# EAGLE design TUD (EAGLE 6.2)
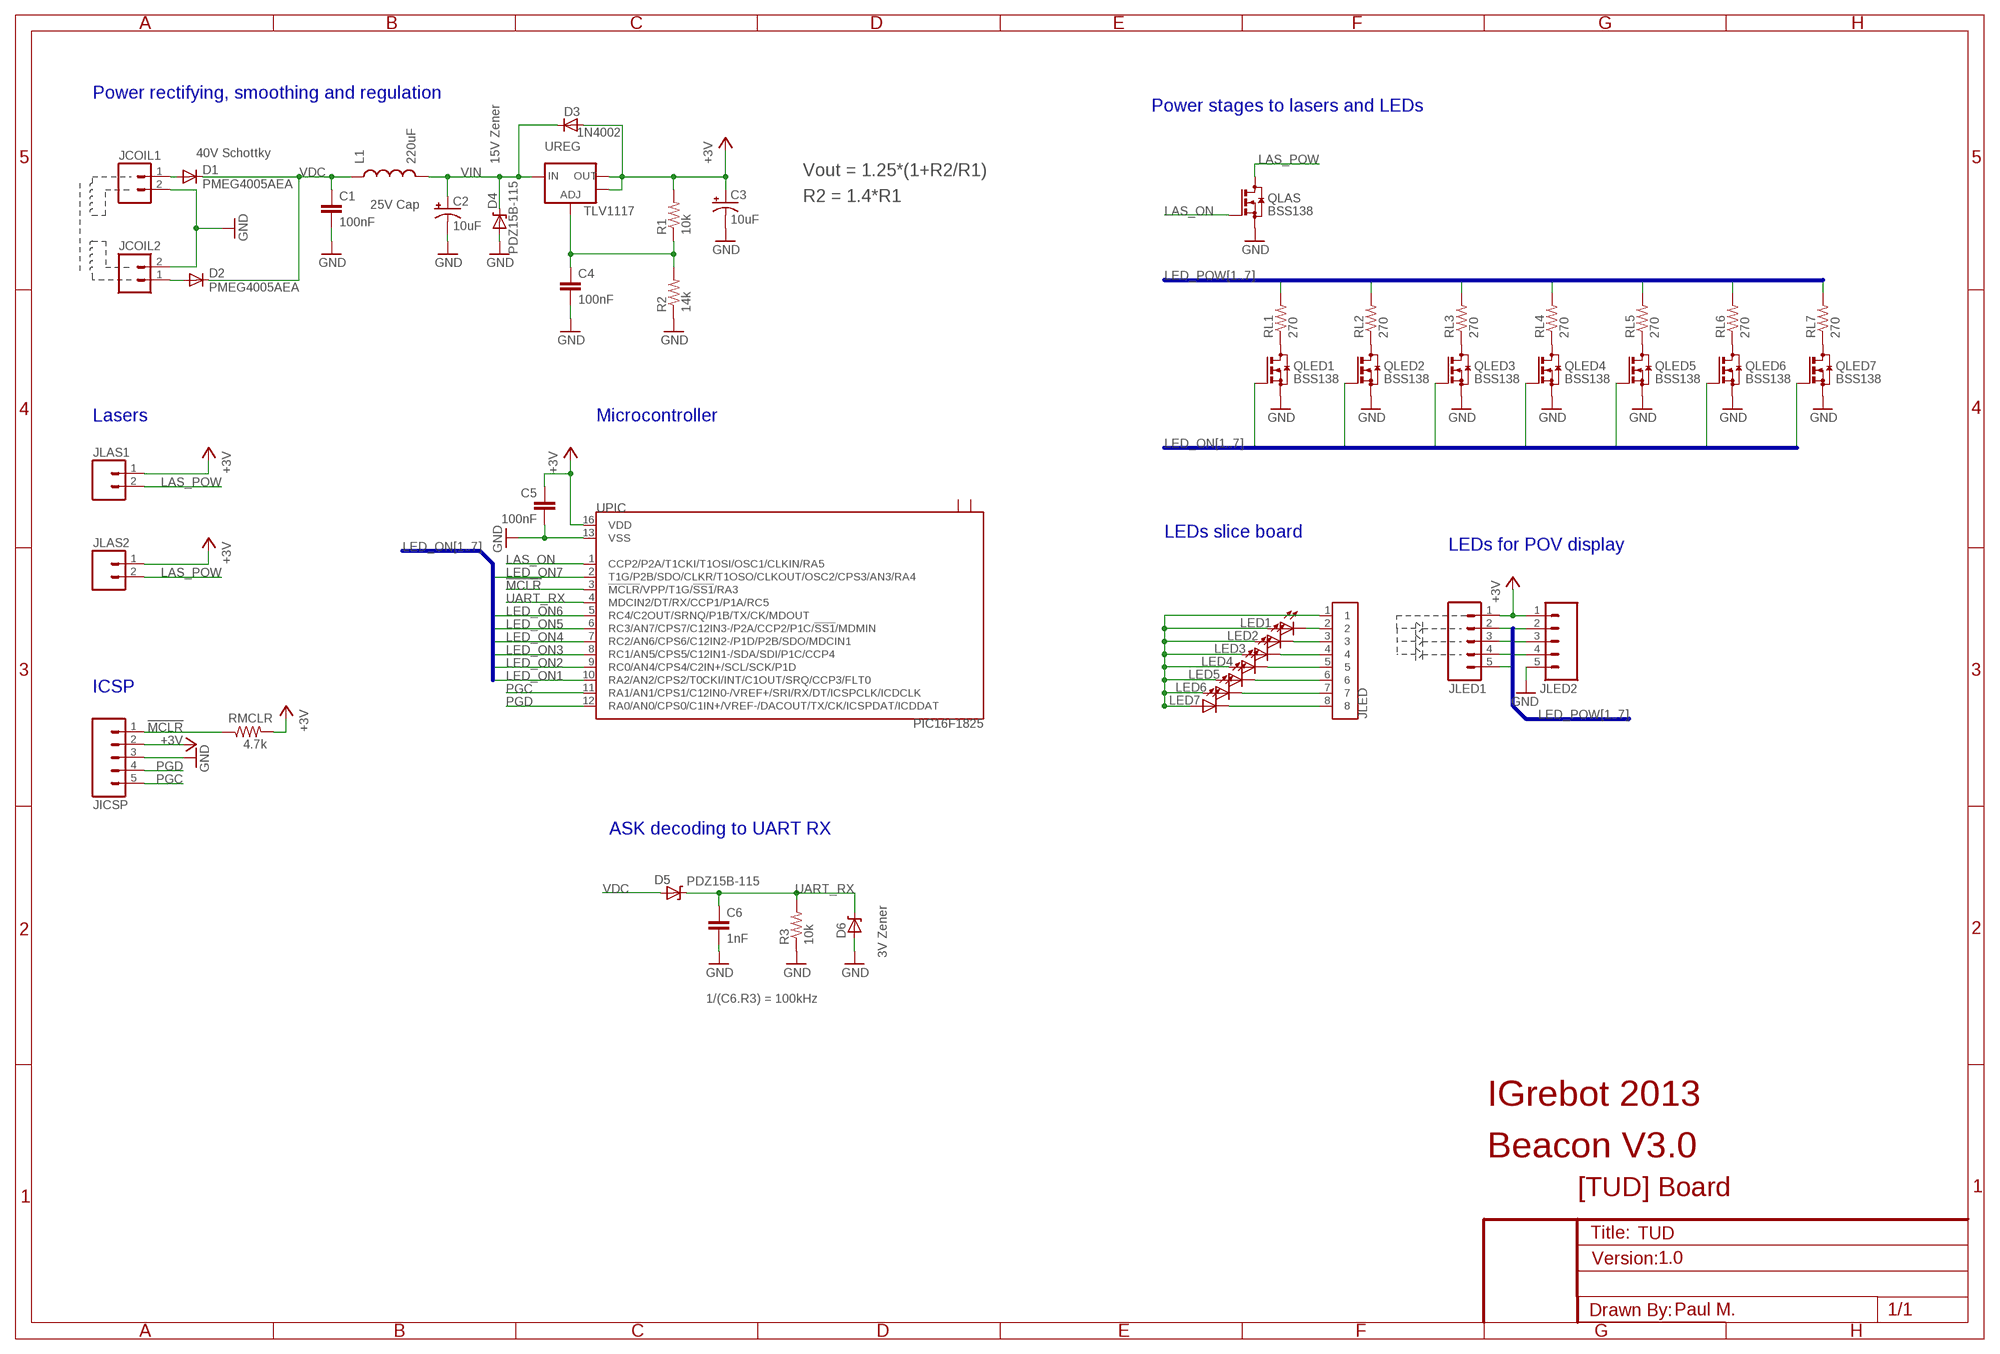
[diagram p0: schematic, sheet 1]

## Parts
C1  100nF  CAP0603-CAP  [0603-CAP]
C2  10uF  CAP_POL3528  [EIA3528]
C3  10uF  CAP_POL3528  [EIA3528]
C4  100nF  CAP0603-CAP  [0603-CAP]
C5  100nF  CAP0603-CAP  [0603-CAP]
C6  1nF  CAP0603-CAP  [0603-CAP]
D1  PMEG4005AEA  DIODESOD  [SOD-323]
D2  PMEG4005AEA  DIODESOD  [SOD-323]
D3  1N4002  DIODESOD  [SOD-323]
D4  PDZ15B-115  DIODE-ZENER-BZT52  [SOD-323]
D5  PDZ15B-115  DIODE-ZENER-BZT52  [SOD-323]
D6  DIODE-ZENER-BZT52  [SOD-323]
JCOIL1  M02LOCK  [1X02_LOCK]
JCOIL2  M02LOCK  [1X02_LOCK]
JICSP  M051.27MM  [1X05-1.27MM]
JLAS1  M02LOCK  [1X02_LOCK]
JLAS2  M02LOCK  [1X02_LOCK]
JLED  CON8_SMD-1  [CON8-SMD-1]
JLED1  M051.27MM  [1X05-1.27MM]
JLED2  M051.27MM  [1X05-1.27MM]
L1  220uF  MCSDC0503-221KU  [L-5X5]
LED1  LED0603  [LED-0603]
LED2  LED0603  [LED-0603]
LED3  LED0603  [LED-0603]
LED4  LED0603  [LED-0603]
LED5  LED0603  [LED-0603]
LED6  LED0603  [LED-0603]
LED7  LED0603  [LED-0603]
QLAS  BSS138  BSS123  [SOT23]
QLED1  BSS138  BSS123  [SOT23]
QLED2  BSS138  BSS123  [SOT23]
QLED3  BSS138  BSS123  [SOT23]
QLED4  BSS138  BSS123  [SOT23]
QLED5  BSS138  BSS123  [SOT23]
QLED6  BSS138  BSS123  [SOT23]
QLED7  BSS138  BSS123  [SOT23]
R1  10k  RESISTOR0603-RES  [0603-RES]
R2  14k  RESISTOR0603-RES  [0603-RES]
R3  10k  RESISTOR0603-RES  [0603-RES]
RL1  270  RESISTOR0603-RES  [0603-RES]
RL2  270  RESISTOR0603-RES  [0603-RES]
RL3  270  RESISTOR0603-RES  [0603-RES]
RL4  270  RESISTOR0603-RES  [0603-RES]
RL5  270  RESISTOR0603-RES  [0603-RES]
RL6  270  RESISTOR0603-RES  [0603-RES]
RL7  270  RESISTOR0603-RES  [0603-RES]
RMCLR  4.7k  RESISTOR0603-RES  [0603-RES]
UPIC  PIC16F1825  [QFN16-0.65]
UREG  TLV1117  V_REG_LM1117SOT223  [SOT223]

## Nets
!MCLR!: JICSP.1 RMCLR.1 UPIC.3(!MCLR!/VPP/T1G/!SS1!/RA3)
+3V3: C3.A(+) C5.1 D3.2(A) JICSP.2 JLAS1.1 JLAS2.1 JLED1.1 JLED2.1 R1.2 RMCLR.2 UPIC.16(VDD) UREG.2(OUT) UREG.4(OUT) ; supply symbol labelled +3V
GND: C1.2 C2.C(-) C3.C(-) C4.2 C5.2 C6.2 D4.2(A) D6.2(A) JCOIL1.2 JCOIL2.2 JICSP.3 JLED2.5 QLAS.2(S) QLED1.2(S) QLED2.2(S) QLED3.2(S) QLED4.2(S) QLED5.2(S) QLED6.2(S) QLED7.2(S) R2.1 R3.1 UPIC.13(VSS)
LAS_ON: QLAS.1(G) UPIC.1(CCP2/P2A/T1CKI/T1OSI/OSC1/CLKIN/RA5)
LAS_POW: JLAS1.2 JLAS2.2 QLAS.3(D)
LED_ON1: QLED1.1(G) UPIC.10(RA2/AN2/CPS2/T0CKI/INT/C1OUT/SRQ/CCP3/FLT0)
LED_ON2: QLED2.1(G) UPIC.9(RC0/AN4/CPS4/C2IN+/SCL/SCK/P1D)
LED_ON3: QLED3.1(G) UPIC.8(RC1/AN5/CPS5/C12IN1-/SDA/SDI/P1C/CCP4)
LED_ON4: QLED4.1(G) UPIC.7(RC2/AN6/CPS6/C12IN2-/P1D/P2B/SDO/MDCIN1)
LED_ON5: QLED5.1(G) UPIC.6(RC3/AN7/CPS7/C12IN3-/P2A/CCP2/P1C/!SS1!/MDMIN)
LED_ON6: QLED6.1(G) UPIC.5(RC4/C2OUT/SRNQ/P1B/TX/CK/MDOUT)
LED_ON7: QLED7.1(G) UPIC.2(T1G/P2B/SDO/CLKR/T1OSO/CLKOUT/OSC2/CPS3/AN3/RA4)
LED_POW1: JLED1.2 RL1.2
LED_POW2: JLED1.3 RL2.2
LED_POW3: JLED1.4 RL3.2
LED_POW4: JLED1.5 RL4.2
LED_POW5: JLED2.2 RL5.2
LED_POW6: JLED2.3 RL6.2
LED_POW7: JLED2.4 RL7.2
N$1: JLED.2 LED1.C
N$2: D1.2(A) JCOIL1.1
N$3: D2.2(A) JCOIL2.1
N$4: JLED.3 LED2.C
N$5: QLED1.3(D) RL1.1
N$6: C4.1 R1.1 R2.2 UREG.1(ADJ)
N$7: QLED2.3(D) RL2.1
N$8: QLED3.3(D) RL3.1
N$9: QLED4.3(D) RL4.1
N$10: QLED5.3(D) RL5.1
N$11: QLED6.3(D) RL6.1
N$12: QLED7.3(D) RL7.1
N$13: JLED.4 LED3.C
N$14: JLED.5 LED4.C
N$15: JLED.6 LED5.C
N$16: JLED.7 LED6.C
N$17: JLED.8 LED7.C
N$18: JLED.1 LED1.A LED2.A LED3.A LED4.A LED5.A LED6.A LED7.A
PGC: JICSP.5 UPIC.11(RA1/AN1/CPS1/C12IN0-/VREF+/SRI/RX/DT/ICSPCLK/ICDCLK)
PGD: JICSP.4 UPIC.12(RA0/AN0/CPS0/C1IN+/VREF-/DACOUT/TX/CK/ICSPDAT/ICDDAT)
UART_RX: C6.1 D5.1(C) D6.1(C) R3.2 UPIC.4(MDCIN2/DT/RX/CCP1/P1A/RC5)
VDC: C1.1 D1.1(C) D2.1(C) D5.2(A) L1.1
VIN: C2.A(+) D3.1(C) D4.1(C) L1.2 UREG.3(IN)
Unconnected: UPIC.14(NC1) UPIC.15(NC2)

## Buses
LED_ON[1..7]
LED_POW[1..7]

## Notes on the sheet
- Power rectifying, smoothing and regulation
- Power stages to lasers and LEDs
- 40V Schottky
- 15V Zener
- Vout = 1.25*(1+R2/R1)
- R2 = 1.4*R1
- 25V Cap
- Lasers | Microcontroller
- LEDs slice board
- LEDs for POV display
- ICSP
- ASK decoding to UART RX
- 3V Zener
- 1/(C6.R3) = 100kHz
- IGrebot 2013
- Beacon V3.0
- [TUD] Board
- 1.0
- Paul M.

## Library data of the parts
C1 C4-C6 = SparkFun-Passives:CAP: Capacitor Standard 0603 ceramic capacitor, and 0.1" leaded capacitor.
C2 C3 = SparkFun-Passives:CAP_POL: Capacitor Polarized These are standard SMD and PTH capacitors. Normally 10uF, 47uF, and 100uF in electrolytic and tantalum varieties. Always verify the external diameter of the through hole cap, it varies with capacity, voltage, and manufacturer. The EIA devices should be standard.
D1-D3 = SparkFun-DiscreteSemi:DIODE: Diode These are standard reverse protection diodes and small signal diodes. SMA package can handle up to about 1A. SOD-323 can handle about 200mA. What the SOD-323 package when ordering, there are some mfgs out there that are 5-pin packages.
D4-D6 = SparkFun-DiscreteSemi:DIODE-ZENER: Zener Diode Production Part - 8199 3.4V Zener Voltage
JCOIL1 JCOIL2 JLAS1 JLAS2 = SparkFun-Connectors:M02: Header 2 Standard 2-pin 0.1" header. Use with straight break away headers (SKU : PRT-00116), right angle break away headers (PRT-00553), swiss pins (PRT-00743), machine pins (PRT-00117), and female headers (PRT-00115). Molex polarized connector foot print use with SKU : PRT-08233 with associated crimp pins and housings.
JICSP JLED1 JLED2 = SparkFun-Connectors:M05: Header 5 Standard 5-pin 0.1" header. Use with straight break away headers (SKU : PRT-00116), right angle break away headers (PRT-00553), swiss pins (PRT-00743), machine pins (PRT-00117), and female headers (PRT-00115). Molex polarized connector foot print use with SKU : PRT-08230 with associated crimp pins and housings.
JLED = lib_paul_v6:CON8_SMD-1
L1 = lib_paul_v6:MCSDC0503-221KU
LED1-LED7 = SparkFun-LED:LED: LEDs Standard schematic elements and footprints for 5mm, 3mm, 1206, and 0603 sized LEDs. 5mm - Spark Fun Electronics SKU : COM-00529 (and others)
QLAS QLED1-QLED7 = transistor-small-signal:BSS123: N-CHANNEL MOS FET
R1-R3 RL1-RL7 RMCLR = SparkFun-Passives:RESISTOR: Resistor Basic schematic elements and footprints for 0603, 1206, and PTH resistors.
UPIC = lib_paul_v6:PIC16F1825
UREG = SparkFun-PowerIC:V_REG_LM1117: Voltage Regulator LM1117 Standard adjustable voltage regulator but in SMD form. Spark Fun Electronics SKU : COM-00595

## Board
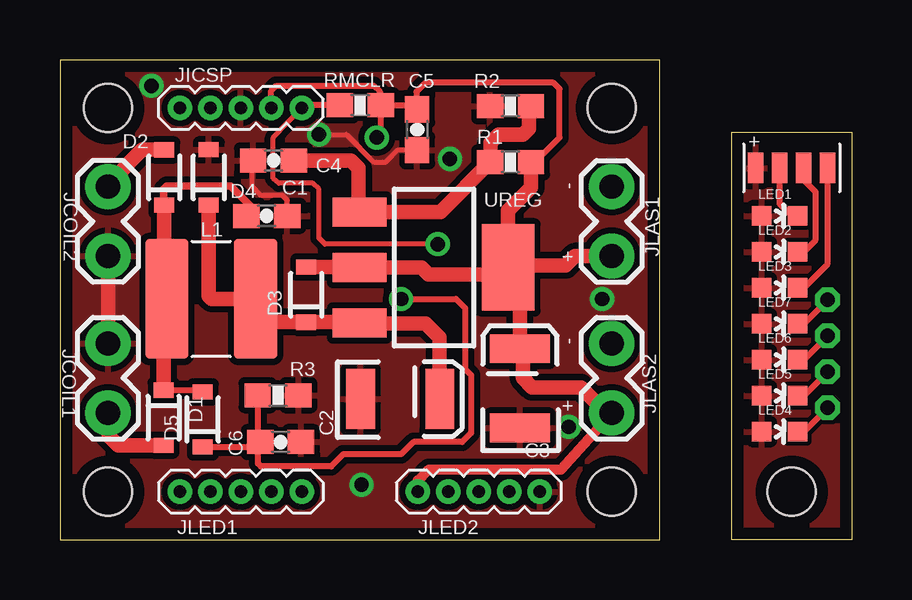
[diagram p1: board, top side]
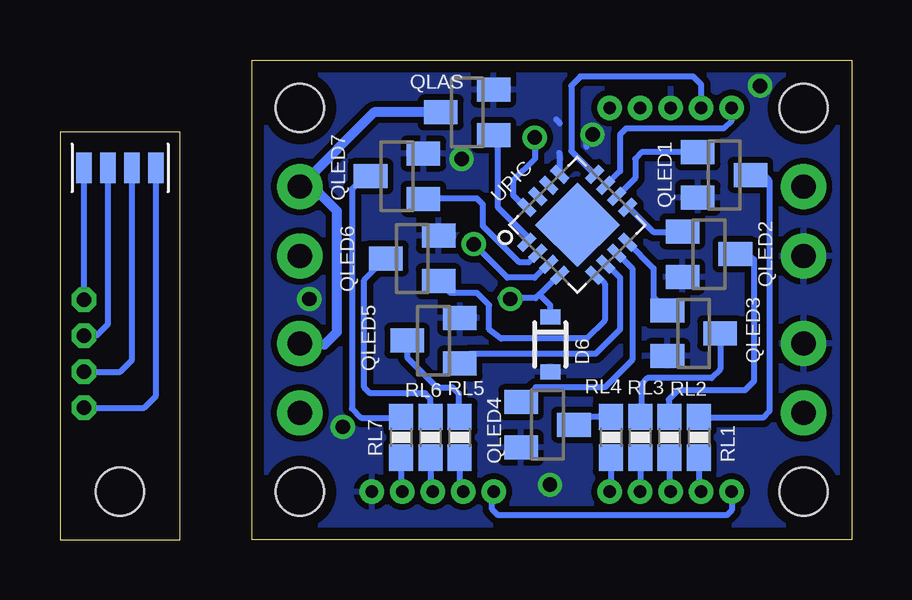
[diagram p2: board, bottom side, seen from below]

Size 33 x 20 mm. Coordinates in mm from the lower left corner, seen from the top.
Outline: 0,0 25,0 25,20 0,20 0,0
Outline: 28,0 28,17 33,17 33,0 28,0
Copper layers (1*16): Top 0.035mm / dielectric 1.5mm / Bottom 0.035mm
Design rules: minimum track width 8mil, minimum drill 0.5mm, track to track 7mil, track to pad 7mil, pad to pad 7mil, via to via 7mil, smd to smd 7mil, copper to edge 0.5mm, drill to drill 8mil, minimum pad ring 10mil, minimum via ring 8mil, stop-mask expansion 4mil, vias tented up to drill 0mil, thermal gap 10mil
Holes 2 mm at 2,18 2,2 23,18 23,2 30.5,2

### Footprints (pad centres in the part's own frame; a part is rotated, then mirrored left to right if it is on the bottom)
0603-CAP = smd 1.1 x 1: 1 -0.85,0; 2 0.85,0
EIA3528 = smd 1.2 x 2.5: A 1.65,0; C -1.65,0
SOD-323 = smd 0.63 x 0.83: 1 -1.15,0; 2 1.15,0
1X02_LOCK = drill 1.016 pad 1.88: 1 -0.178,0; 2 2.718,0
1X05-1.27MM = drill 0.508 pad 1: 1 0,0; 2 1.27,0; 3 2.54,0; 4 3.81,0; 5 5.08,0
CON8-SMD-1 = smd 0.66 x 1.27: 1 -1.5,0; 2 -0.5,0; 3 0.5,0; 4 1.5,0 | smd 0.66 x 1.27 bottom: 5 -1.5,0; 6 -0.5,0; 7 0.5,0; 8 1.5,0
L-5X5 = smd 1.8 x 5: 1 -1.85,0; 2 1.85,0
LED-0603 = smd 0.8 x 0.8: A 0,-0.75; C 0,0.75
SOT23 = smd 1 x 1.4: 1 -0.95,-1.1; 2 0.95,-1.1; 3 0,1.1
0603-RES = smd 1.1 x 1: 1 -0.85,0; 2 0.85,0
QFN16-0.65 = smd 0.8 x 0.35: 1 -2,0.975; 2 -2,0.325; 3 -2,-0.325; 4 -2,-0.975; 9 2,-0.975; 10 2,-0.325; 11 2,0.325; 12 2,0.975 | smd 0.35 x 0.8: 5 -0.975,-2; 6 -0.325,-2; 7 0.325,-2; 8 0.975,-2; 13 0.975,2; 14 0.325,2; 15 -0.325,2; 16 -0.975,2 | smd 2.5 x 2.5: PAD 0,0
SOT223 = smd 1.219 x 2.235: 1 -2.311,-3.099; 2 0,-3.099; 3 2.311,-3.099 | smd 3.6 x 2.2: 4 0,3.099

### Placement (x,y rotation side)
C1  8.62,13.49 0 top
C2  14.18,5.86 0 top
C3  19.18,6.31 90 top
C4  8.9,15.81 180 top
C5  14.89,17.09 270 top
C6  9.2,4.07 0 top
D1  4.32,5.08 270 top
D2  4.35,15.1 90 top
D3  10.27,10.21 90 top
D4  6.21,15.1 90 top
D5  5.95,5.01 90 top
D6  12.56,8.14 270 bottom
JCOIL1  2,5.46 90 top
JCOIL2  2,14.54 270 top
JICSP  10.08,18 180 top
JLAS1  23,12 90 top
JLAS2  23,5.46 90 top
JLED  30.5,15.5 0 top
JLED1  5,2 0 top
JLED2  14.92,2 0 top
L1  6.31,10.03 0 top
LED1  30,13.5 270 top
LED2  30,12 270 top
LED3  30,10.5 270 top
LED4  30,4.5 270 top
LED5  30,6 270 top
LED6  30,7.5 270 top
LED7  30,9 270 top
QLAS  16.02,17.82 90 bottom
QLED1  5.31,15.2 270 bottom
QLED2  5.95,11.9 270 bottom
QLED3  6.58,8.6 270 bottom
QLED4  12.67,4.79 270 bottom
QLED5  17.43,8.29 90 bottom
QLED6  18.32,11.72 90 bottom
QLED7  18.95,15.15 90 bottom
R1  18.79,15.73 0 top
R2  18.79,18.07 0 top
R3  9.09,6.01 180 top
RL1  6.37,4.26 270 bottom
RL2  7.59,4.26 270 bottom
RL3  8.81,4.26 270 bottom
RL4  10.03,4.26 270 bottom
RL5  16.34,4.26 270 bottom
RL6  17.56,4.26 270 bottom
RL7  18.78,4.26 270 bottom
RMCLR  12.52,18.11 0 top
UPIC  11.43,13.12 45 bottom
UREG  15.59,11.35 270 top

### Tracks (layer width: path | path; a pad name or v marks a point on that pad's centre or on a via)
!MCLR!  (via drill 0.6)
  Top 0.203: v15.75,12.32 11.05,12.32 10.79,12.57 10.79,14.61 10.54,14.86 9.12,14.86 8.89,15.06 8.89,16.76 JICSP.1
  Top 0.254: RMCLR.1 10.19,18.11 JICSP.1
  Bottom 0.254: UPIC.3 12.65,11.48 13.21,10.92 14.35,10.92 v15.75,12.32
+3V3  (via drill 0.6)
  Top 0.254: JICSP.2 8.81,18.72 9.02,18.92 13.08,18.92 13.34,18.67 13.34,18.02 RMCLR.2 | RMCLR.2 13.37,16.93 v13.21,16.76 | 14.72,17.98 C5.1 | R1.2 19.8,15.73 20.83,16.76 20.83,18.8 20.57,19.05 15.24,19.05 14.86,18.67 14.86,17.97 C5.1 | RMCLR.2 14.72,18.11 C5.1
  Top 0.406: JLED2.1 14.92,2.47 15.37,2.92 20.89,2.92 JLAS2.1
  Top 0.61: D3.2 12.47,11.36 UREG.2 15.07,11.35 15.37,11.05 18.39,11.05 UREG.4 | UREG.4 19.18,10.73 C3.A 19.3,7.96 19.3,6.73 19.68,6.35 21.72,6.35 22.79,5.28 JLAS2.1 | R1.2 19.64,14.68 18.67,13.72 18.67,11.37 UREG.4 | JLAS1.1 21.47,11.82 21.08,11.43 18.77,11.43 UREG.4
  Bottom 0.254: UPIC.16 13.6,13.85 14.1,14.35 14.1,14.99 13.21,15.88 v13.21,16.76 | JLED1.1 5,1.22 5.21,1.02 14.73,1.02 14.99,1.27 14.99,1.93 JLED2.1
GND  (via drill 0.6)
  Top 0.203: C1.2 9.47,14.15 9.27,14.35 8.38,14.35 8,14.73 8,15.76 C4.2 | v10.79,16.89 11.94,16.89 13.08,15.75 13.59,15.75 14.1,16.26 14.88,16.26 C5.2
  Top 0.61: JCOIL2.2 JCOIL1.2
  Bottom 0.254: 12.16,15.28 UPIC.13 12.16,16.09 12.19,16.13 | 11.05,16.38 11.05,16.76 | 12.16,17.36 12.32,17.53
  other vias: 12.57,2.29 3.81,18.92 22.61,10.03 16.26,15.88 21.21,4.7
  pour Top (isolate 0.254): 0,19.94 25.02,19.94 25.02,0 0,0
  pour Bottom (isolate 0.254): 0,20.07 0,-0.13 25.02,-0.13 25.02,20.07
LAS_ON
  Bottom 0.254: UPIC.1 13.54,12.65 14.73,13.84 14.73,16.68 QLAS.1
LAS_POW
  Bottom 0.406: QLAS.3 19.9,17.82 JLAS1.2 22.46,14.72 21.46,13.72 21.46,8.64 21.97,8.13 22.95,8.13 JLAS2.2
LED_ON1
  Bottom 0.254: QLED1.1 8.74,16.15 9.02,15.88 9.02,15.08 UPIC.10
LED_ON2
  Bottom 0.254: UPIC.9 9.28,13.85 8.26,12.83 7.07,12.83 QLED2.1
LED_ON3
  Bottom 0.254: QLED3.1 8.26,10.12 8.26,11.3 9.33,12.38 UPIC.8
LED_ON4
  Bottom 0.254: QLED4.1 13.16,6.35 10.29,6.35 9.14,7.49 9.14,11.3 UPIC.7
LED_ON5
  Bottom 0.254: QLED5.1 15.92,7.75 10.67,7.75 9.65,8.76 9.65,10.92 10.21,11.48 UPIC.6
LED_ON6
  Bottom 0.254: QLED6.1 16.73,10.29 15.62,10.29 15.11,9.78 15.11,8.76 14.61,8.38 11.05,8.38 10.29,9.14 10.29,10.67 10.64,11.02 UPIC.5
LED_ON7
  Bottom 0.254: UPIC.2 13.46,11.56 13.84,11.56 15.37,13.08 15.37,13.97 15.62,14.22 17.83,14.22 QLED7.1
LED_POW1
  Bottom 0.254: RL1.2 6.37,2.1 JLED1.2
LED_POW2
  Bottom 0.254: RL2.2 7.59,2.05 JLED1.3
LED_POW3
  Bottom 0.254: RL3.2 JLED1.4
LED_POW4
  Bottom 0.254: RL4.2 10.03,2.05 JLED1.5
LED_POW5
  Bottom 0.254: RL5.2 16.34,2.15 JLED2.2
LED_POW6
  Bottom 0.254: RL6.2 17.56,2.1 JLED2.3
LED_POW7
  Bottom 0.254: RL7.2 18.78,2.05 JLED2.4
N$1
  Top 0.254: LED1.C 30.5,13.5 30,14 JLED.2
N$2
  Top 0.61: D1.2 2.42,3.93 2.03,4.32 2.03,5.25 JCOIL1.1
N$3
  Top 0.61: JCOIL2.1 2,14.83 3.43,16.26 D2.2
N$4
  Top 0.254: LED2.C 31,12 31.5,12.5 31.5,14.5 31,15 JLED.3
N$5
  Bottom 0.254: QLED1.3 4.03,15.58 3.43,14.99 3.43,5.33 3.68,5.08 6.33,5.08 RL1.1
N$6
  Top 0.61: C4.1 12.13,15.81 12.45,15.49 12.45,13.7 UREG.1 15.86,13.66 R1.1 17.96,15.76 17.96,16.56 18.29,16.89 19.3,16.89 19.56,17.14 19.56,17.99 R2.2
N$7
  Bottom 0.254: QLED2.3 4.66,12.28 4.06,11.68 4.06,6.6 4.45,6.22 7.24,6.22 7.62,5.84 7.62,5.14 RL2.1
N$8
  Bottom 0.254: QLED3.3 5.48,7.09 5.84,6.73 8.51,6.73 8.76,6.48 8.76,5.16 RL3.1
N$9
  Bottom 0.254: RL4.1 11.25,5.11 QLED4.3
N$10
  Bottom 0.254: QLED5.3 18.53,7.6 17.27,6.35 16.64,6.35 16.38,6.1 16.38,5.16 RL5.1
N$11
  Bottom 0.254: RL6.1 17.56,5.87 17.78,6.1 20.07,6.1 20.32,6.35 20.32,10.82 QLED6.3
N$12
  Bottom 0.254: QLED7.3 20.28,15.15 20.83,14.61 20.83,5.46 20.45,5.08 18.81,5.08 RL7.1
N$13
  Top 0.254: JLED.4 32,11.5 31,10.5 LED3.C
N$14  (via drill 0.6)
  Top 0.254: LED4.C 31,4.5 v32,5.5
  Bottom 0.254: v32,5.5 29.5,5.5 29,6 JLED.5
N$15  (via drill 0.6)
  Top 0.254: LED5.C 31,6 v32,7
  Bottom 0.254: v32,7 30.5,7 30,7.5 JLED.6
N$16  (via drill 0.6)
  Top 0.254: LED6.C 31,7.5 v32,8.5
  Bottom 0.254: v32,8.5 31.5,8.5 31,9 JLED.7
N$17  (via drill 0.6)
  Top 0.254: LED7.C 31,9 v32,10
  Bottom 0.254: v32,10 JLED.8
N$18
  pour Top: 28,17 33,17 33,0 28,0
PGC
  Bottom 0.254: UPIC.11 9.65,15.36 9.65,16.89 9.4,17.14 5.33,17.14 5,17.48 JICSP.5
PGD
  Bottom 0.254: JICSP.4 6.27,18.97 6.6,19.3 11.3,19.3 11.68,18.92 11.68,16.2 UPIC.12
UART_RX  (via drill 0.6)
  Top 0.254: D5.1 7.76,3.86 C6.1 | R3.2 8.24,4.18 C6.1 | v14.22,10.03 16.51,10.03 16.89,9.65 16.89,7.11 17.14,6.86 17.14,4.45 16.76,4.06 14.73,4.06 14.22,3.56 11.81,3.56 11.3,3.05 8.38,3.05 8.26,3.17 8.26,3.97 C6.1
  Bottom 0.254: UPIC.4 12.22,11.02 13.02,10.22 | 13.02,10.22 13.17,10.07 14.64,10.07 v14.22,10.03 | D6.1 12.56,9.77 13.02,10.22
VDC
  Top 0.254: D1.1 6.13,6.23 D5.2
  Top 0.305: C1.1 8.03,13.82 7.11,14.73 4.45,14.73 4.32,14.61 4.32,13.98 D2.1
  Top 0.61: D2.1 4.35,10.14 L1.1 4.32,9.9 D1.1
VIN
  Top 0.61: D4.1 6.21,10.16 6.33,10.03 L1.2 8.13,10.01 8.13,9.4 8.46,9.06 D3.1 12.46,9.06 UREG.3 12.51,9.02 15.24,9.02 15.83,8.43 C2.A

### Text on the board
tNames: + | - | + | - | +